# EAGLE schematic MIDI Thru (EAGLE 8.2.2)
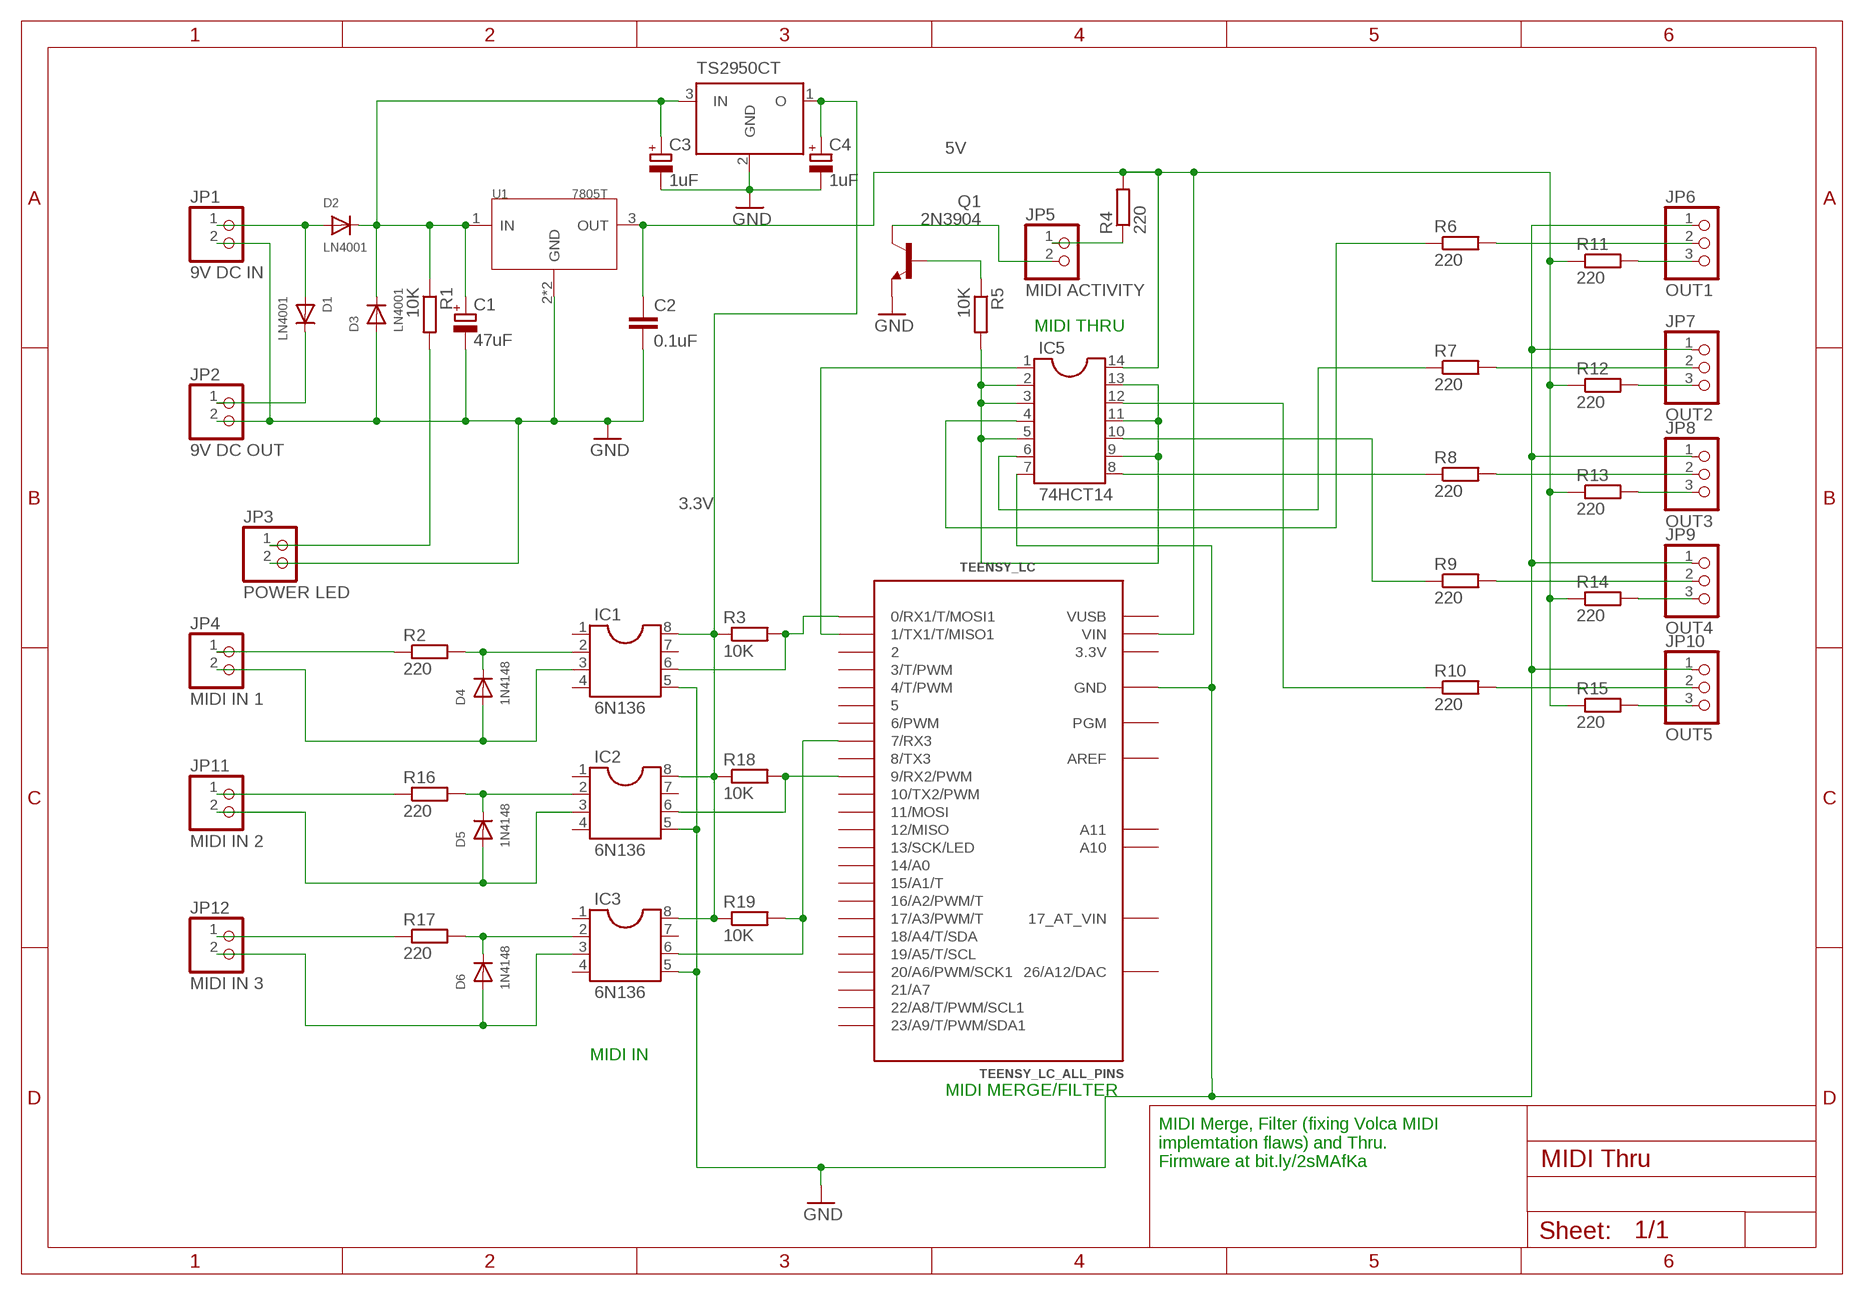
[diagram p0: schematic, sheet 1]

## Parts
C1  47uF  CPOL-EUE5-10.5  [E5-10,5]
C2  0.1uF  C-EU025-025X050  [C025-025X050]
C3  1uF  CPOL-EUE5-10.5  [E5-10,5]
C4  1uF  CPOL-EUE5-10.5  [E5-10,5]
D1  LN4001  DIODEDO-1N4148  [DO-1N4148]
D2  LN4001  DIODEDO-1N4148  [DO-1N4148]
D3  LN4001  DIODEDO-1N4148  [DO-1N4148]
D4  1N4148  DIODEDO-1N4148  [DO-1N4148]
D5  1N4148  DIODEDO-1N4148  [DO-1N4148]
D6  1N4148  DIODEDO-1N4148  [DO-1N4148]
IC1  6N136  DIL8  [DIL08]
IC2  6N136  DIL8  [DIL08]
IC3  6N136  DIL8  [DIL08]
IC5  74HCT14  DIL14S  [SOCKET-14]
JP1  9V DC IN  PINHD-1X2  [1X02]
JP2  9V DC OUT  PINHD-1X2  [1X02]
JP3  POWER LED  PINHD-1X2  [1X02]
JP4  MIDI IN 1  PINHD-1X2  [1X02]
JP5  MIDI ACTIVITY  PINHD-1X2  [1X02]
JP6  OUT1  PINHD-1X3  [1X03]
JP7  OUT2  PINHD-1X3  [1X03]
JP8  OUT3  PINHD-1X3  [1X03]
JP9  OUT4  PINHD-1X3  [1X03]
JP10  OUT5  PINHD-1X3  [1X03]
JP11  MIDI IN 2  PINHD-1X2  [1X02]
JP12  MIDI IN 3  PINHD-1X2  [1X02]
Q1  2N3904  [TO92]
R1  10K  R0204/7  [0204/7]
R2  220  R0204/7  [0204/7]
R3  10K  R0204/7  [0204/7]
R4  220  R0204/7  [0204/7]
R5  10K  R0204/7  [0204/7]
R6  220  R0204/7  [0204/7]
R7  220  R0204/7  [0204/7]
R8  220  R0204/7  [0204/7]
R9  220  R0204/7  [0204/7]
R10  220  R0204/7  [0204/7]
R11  220  R0204/7  [0204/7]
R12  220  R0204/7  [0204/7]
R13  220  R0204/7  [0204/7]
R14  220  R0204/7  [0204/7]
R15  220  R0204/7  [0204/7]
R16  220  R0204/7  [0204/7]
R17  220  R0204/7  [0204/7]
R18  10K  R0204/7  [0204/7]
R19  10K  R0204/7  [0204/7]
TEENSY_LC  TEENSY_LC_ALL_PINS  [TEENSY_3.0-3.2&LC_ALL_PINS]
TS2950CT  LP2950Z  [TO92]
U1  7805T  PMIC-ST-L7805CV(TO-220)  [TO-220]

## Nets
3.3V: C4.+ IC1.8 IC2.8 IC3.8 R3.1 R18.1 R19.1 TS2950CT.1(O)
5V: C2.1 IC5.14 R4.2 R11.1 R12.1 R13.1 R14.1 R15.1 TEENSY_LC.VIN U1.3(OUT)
GND: C1.- C2.2 C3.- C4.- D3.A IC1.5 IC2.5 IC3.5 IC5.7 JP1.2 JP2.2 JP3.2 JP6.1 JP7.1 JP8.1 JP9.1 JP10.1 Q1.3(E) TEENSY_LC.AGND(GND) TEENSY_LC.GND TEENSY_LC.GND1(GND) TS2950CT.2(GND) U1.2(GND) U1.HEAT(GND)
N$1: D4.C IC1.2 R2.2
N$2: D4.A IC1.3 JP4.2
N$3: JP11.1 R16.1
N$4: D5.A IC2.3 JP11.2
N$5: JP12.1 R17.1
N$6: D6.A IC3.3 JP12.2
N$7: JP4.1 R2.1
N$8: IC1.6 R3.2 TEENSY_LC.0(0/RX1/T/MOSI1)
N$9: D5.C IC2.2 R16.2
N$10: IC2.6 R18.2 TEENSY_LC.9(9/RX2/PWM)
N$11: IC3.6 R19.2 TEENSY_LC.7(7/RX3)
N$12: D6.C IC3.2 R17.2
N$13: IC5.1 TEENSY_LC.1(1/TX1/T/MISO1)
N$14: IC5.4 R6.1
N$15: JP6.2 R6.2
N$17: JP6.3 R11.2
N$18: JP7.3 R12.2
N$19: JP8.3 R13.2
N$20: JP9.3 R14.2
N$21: JP10.3 R15.2
N$23: IC5.6 R7.1
N$24: JP7.2 R7.2
N$25: Q1.2(B) R5.1
N$26: IC5.8 R8.1
N$27: JP8.2 R8.2
N$28: IC5.10 R9.1
N$29: JP9.2 R9.2
N$30: IC5.12 R10.1
N$31: JP10.2 R10.2
N$32: JP5.2 Q1.1(C)
N$33: IC5.2 IC5.3 IC5.5 IC5.9 IC5.11 IC5.13 R5.2
N$34: JP5.1 R4.1
N$35: D1.A D2.A JP1.1
N$36: D1.C JP2.1
N$38: C1.+ C3.+ D2.C D3.C R1.1 TS2950CT.3(IN) U1.1(IN)
N$39: JP3.1 R1.2
Unconnected: IC1.1 IC1.4 IC1.7 IC2.1 IC2.4 IC2.7 IC3.1 IC3.4 IC3.7 TEENSY_LC.2 TEENSY_LC.3(3/T/PWM) TEENSY_LC.4(4/T/PWM) TEENSY_LC.5 TEENSY_LC.6(6/PWM) TEENSY_LC.8(8/TX3) TEENSY_LC.10(10/TX2/PWM) TEENSY_LC.11(11/MOSI) TEENSY_LC.12(12/MISO) TEENSY_LC.13(13/SCK/LED) TEENSY_LC.14/A0 TEENSY_LC.15/A1(15/A1/T) TEENSY_LC.16/A2(16/A2/PWM/T) TEENSY_LC.17/A3(17/A3/PWM/T) TEENSY_LC.18/A4(18/A4/T/SDA) TEENSY_LC.19/A5(19/A5/T/SCL) TEENSY_LC.20/A6(20/A6/PWM/SCK1) TEENSY_LC.21/A7 TEENSY_LC.22/A8(22/A8/T/PWM/SCL1) TEENSY_LC.23/A9(23/A9/T/PWM/SDA1) TEENSY_LC.A10 TEENSY_LC.A11 TEENSY_LC.PGM TEENSY_LC.VBAT(17_AT_VIN)

## Notes on the sheet
- MIDI THRU
- MIDI IN
- MIDI MERGE/FILTER
- MIDI Merge, Filter (fixing Volca MIDI 
  implemtation flaws) and Thru. 
  Firmware at bit.ly/2sMAfKa

## Power pins joined to a net without a drawn wire
3.3V: TEENSY_LC.3.3V TEENSY_LC.3.3V1(3.3V)
26/A12/DAC: TEENSY_LC.RESET/DAC(26/A12/DAC)
AREF: TEENSY_LC.AREF
VUSB: TEENSY_LC.VUSB

## Library data of the parts
C1 C3 C4 = rcl:CPOL-EU: POLARIZED CAPACITOR, European symbol
C2 = resistor:C-EU: CAPACITOR, European symbol
D1-D6 = adafruit:DIODE: Diode SMADIODE - SMA Surface Mount Package 20V 1A Schottky Diode Digikey: 641-1014-6-ND DO-1N4148 - Through Hole Small Current Diode SOD-123 20V 1 A (.5mV Vf) Schottky Diode - Digikey: MBRX120TPMSCT-ND SOD-323 10V 570mA (.38mV Vf, 3ns) Schottky Diode - Digikey: ZLLS410CT-ND SOD-523 30V 30mA Schottky Diode (RB751S-40TE61) - Digikey: RB751S-40TE61CT-ND SOT23-R/W - SOT23 Package (R = Solder Paste/Reflow Ovens, W = Hand-Soldering) BAT54Film 40V 300mA - Digikey: 497-7162-1-ND
IC1-IC3 = ic-package:DIL8: Dual In Line / Socket
IC5 = ic-package:DIL14: Dual In Line / Socket
JP1-JP5 JP11 JP12 = pinhead:PINHD-1X2: PIN HEADER
JP6-JP10 = pinhead:PINHD-1X3: PIN HEADER
Q1 = transistor:2N3904: NPN TRANSISTOR
R1-R19 = eagle-ltspice:R: RESISTOR, European symbol; SPICEMODEL: NONE; SPICEPREFIX: R
TEENSY_LC = Teensy_3_and_LC_Series_Boards_v1.4:TEENSY_LC_ALL_PINS: Teensy LC board with all pins used.
TS2950CT = national-semiconductor:LP2950: Adjustable Micropower Voltage Regulator PIN-Connection corrected by http://www.ti.com/lit/ds/symlink/lp2950-n.pdf; MF: NATIONAL SEMICONDUCTOR; MPN: LP2950CZ-5.0/NOPB; OC_FARNELL: 1150320; OC_NEWARK: 41K6545
U1 = Seeed-IC:PMIC-ST-L7805CV(TO-220): 310030010; MPN: L7805CV